# EAGLE design YOTSUBA_AP_EM_ver.1.1 (EAGLE 9.6.2)
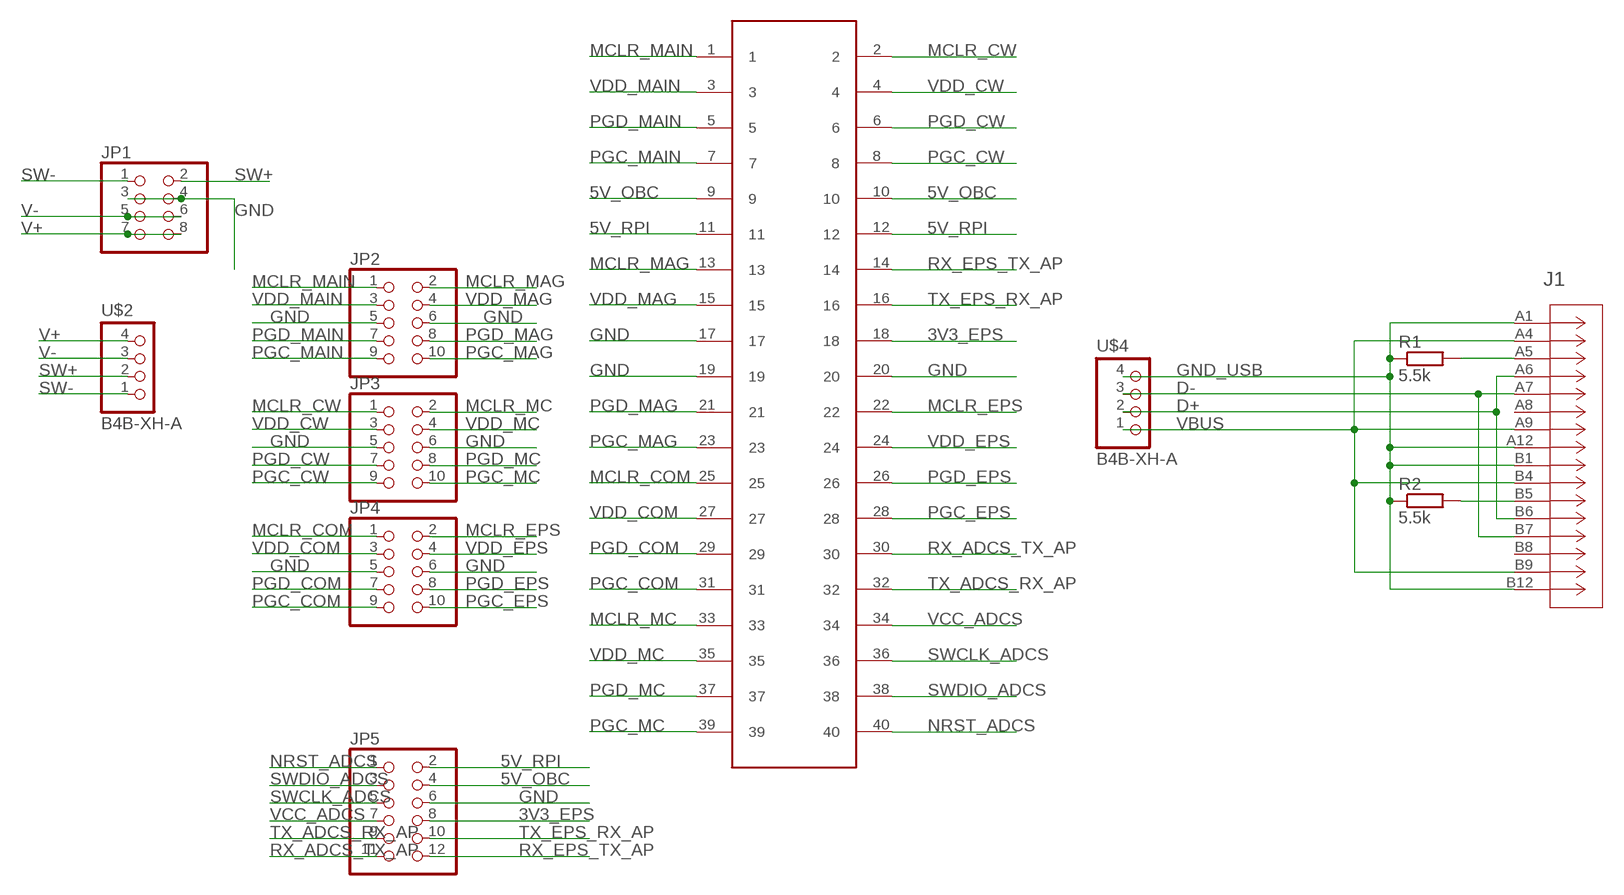
[diagram p0: schematic, sheet 1]

## Parts
J1  217182-0001  [CONN_217182-0001_MOL]
JP1  PINHD-2X4  [2X04]
JP2  PINHD-2X5  [2X05]
JP3  PINHD-2X5  [2X05]
JP4  PINHD-2X5  [2X05]
JP5  PINHD-2X6  [2X06]
R1  5.5k  R-EU_M2012  [M2012]
R2  5.5k  R-EU_M2012  [M2012]
U$1  M50-3902042  [M50-3902042]
U$2  B4B-XH-A  [B4B-XH-A]
U$4  B4B-XH-A  [B4B-XH-A]

## Nets
3V3_EPS: JP5.8 U$1.18
5V_OBC: JP5.4 U$1.9 U$1.10
5V_RPI: JP5.2 U$1.11 U$1.12
D+: J1.A6(DP1) J1.B6(DP2) U$4.2
D-: J1.A7(DN1) J1.B7(DN2) U$4.3
GND [gnd]: JP1.3 JP1.4 JP2.5 JP2.6 JP3.5 JP3.6 JP4.5 JP4.6 JP5.6 U$1.17 U$1.19 U$1.20
GND_USB [gnd_usb]: J1.A1(GND_2) J1.A12(GND_3) J1.B1(GND_4) J1.B12(GND) R1.1 R2.1 U$4.4
MCLR_COM: JP4.1 U$1.25
MCLR_CW: JP3.1 U$1.2
MCLR_EPS: JP4.2 U$1.22
MCLR_MAG: JP2.2 U$1.13
MCLR_MAIN: JP2.1 U$1.1
MCLR_MC: JP3.2 U$1.33
N$2: J1.A5(CC1) R1.2
N$3: J1.B5(CC2) R2.2
NRST_ADCS: JP5.1 U$1.40
PGC_COM: JP4.9 U$1.31
PGC_CW: JP3.9 U$1.8
PGC_EPS: JP4.10 U$1.28
PGC_MAG: JP2.10 U$1.23
PGC_MAIN: JP2.9 U$1.7
PGC_MC: JP3.10 U$1.39
PGD_COM: JP4.7 U$1.29
PGD_CW: JP3.7 U$1.6
PGD_EPS: JP4.8 U$1.26
PGD_MAG: JP2.8 U$1.21
PGD_MAIN: JP2.7 U$1.5
PGD_MC: JP3.8 U$1.37
RX_ADCS_TX_AP: JP5.11 U$1.30
RX_EPS_TX_AP: JP5.12 U$1.14
SW+ [pwr]: JP1.2 U$2.2
SW- [pwr]: JP1.1 U$2.1
SWCLK_ADCS: JP5.5 U$1.36
SWDIO_ADCS: JP5.3 U$1.38
TX_ADCS_RX_AP: JP5.9 U$1.32
TX_EPS_RX_AP: JP5.10 U$1.16
V+ [pwr]: JP1.7 JP1.8 U$2.4
V- [pwr]: JP1.5 JP1.6 U$2.3
VBUS: J1.A4(VBUS_2) J1.A9(VBUS_3) J1.B4(VBUS_4) J1.B9(VBUS) U$4.1
VCC_ADCS: JP5.7 U$1.34
VDD_COM: JP4.3 U$1.27
VDD_CW: JP3.3 U$1.4
VDD_EPS: JP4.4 U$1.24
VDD_MAG: JP2.4 U$1.15
VDD_MAIN: JP2.3 U$1.3
VDD_MC: JP3.4 U$1.35
Unconnected: J1.A8(SBU1) J1.B8(SBU2)

## Library data of the parts
J1 = 2171820001:217182-0001; COPYRIGHT: Copyright (C) 2022 Ultra Librarian. All rights reserved.; DIGI-KEY_PART_NUMBER_1: 900-2171820001TR-ND; DIGI-KEY_PART_NUMBER_2: 900-2171820001CT-ND; DIGI-KEY_PART_NUMBER_3: 900-2171820001DKR-ND; MANUFACTURER_PART_NUMBER: 217182-0001; MFR_NAME: Molex Connector Corporation
JP1 = pinhead:PINHD-2X4: PIN HEADER
JP2-JP4 = pinhead:PINHD-2X5: PIN HEADER
JP5 = pinhead:PINHD-2X6: PIN HEADER
R1 R2 = rcl:R-EU_: RESISTOR, European symbol; SPICEPREFIX: R
U$1 = MITSUBA_Connectors-v4.0:M50-3902042: 40pins 1.27mm pitch 2line pinheader
U$2 U$4 = MITSUBA_Connectors-v4.0:B4B-XH-A

## Net classes
0 default: clearance 0.254 mm
1 gnd: clearance 0.559 mm
2 pwr: clearance 0.229 mm
3 gnd_usb: clearance 0.025 mm

## Board
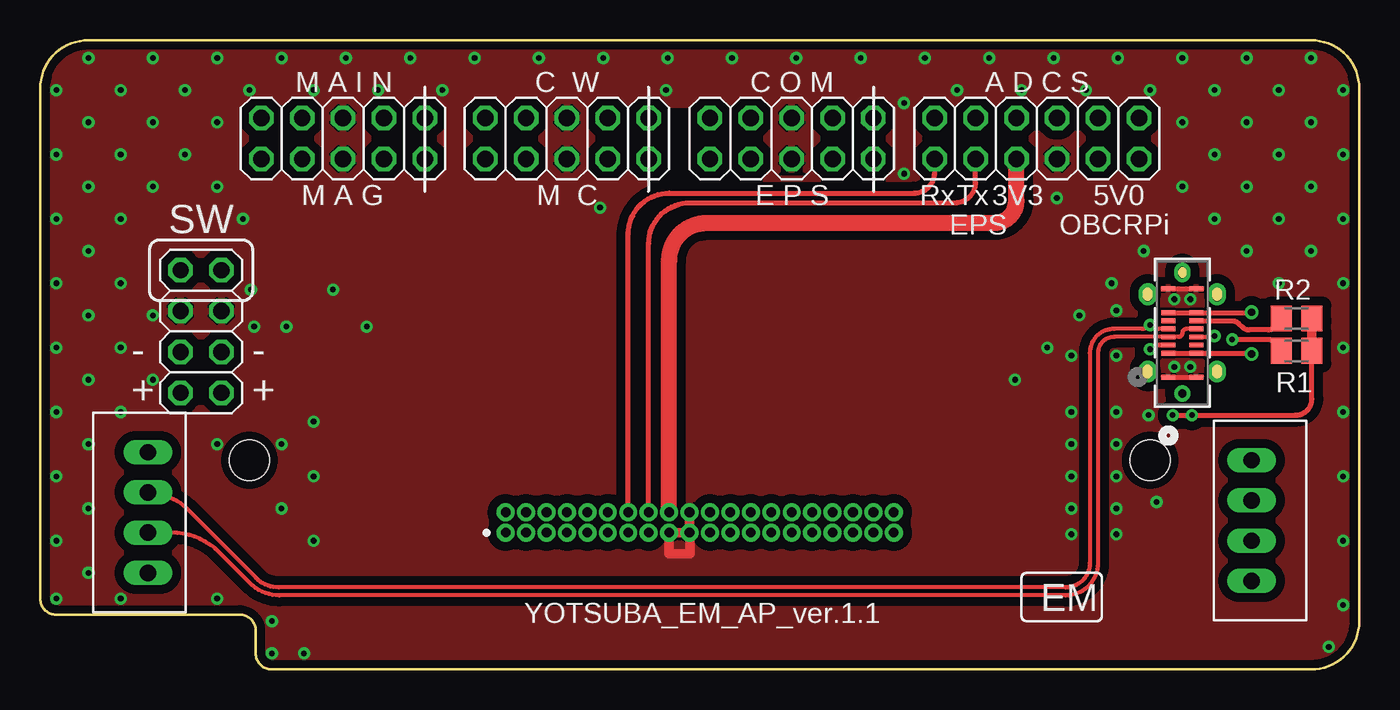
[diagram p1: board, top side]
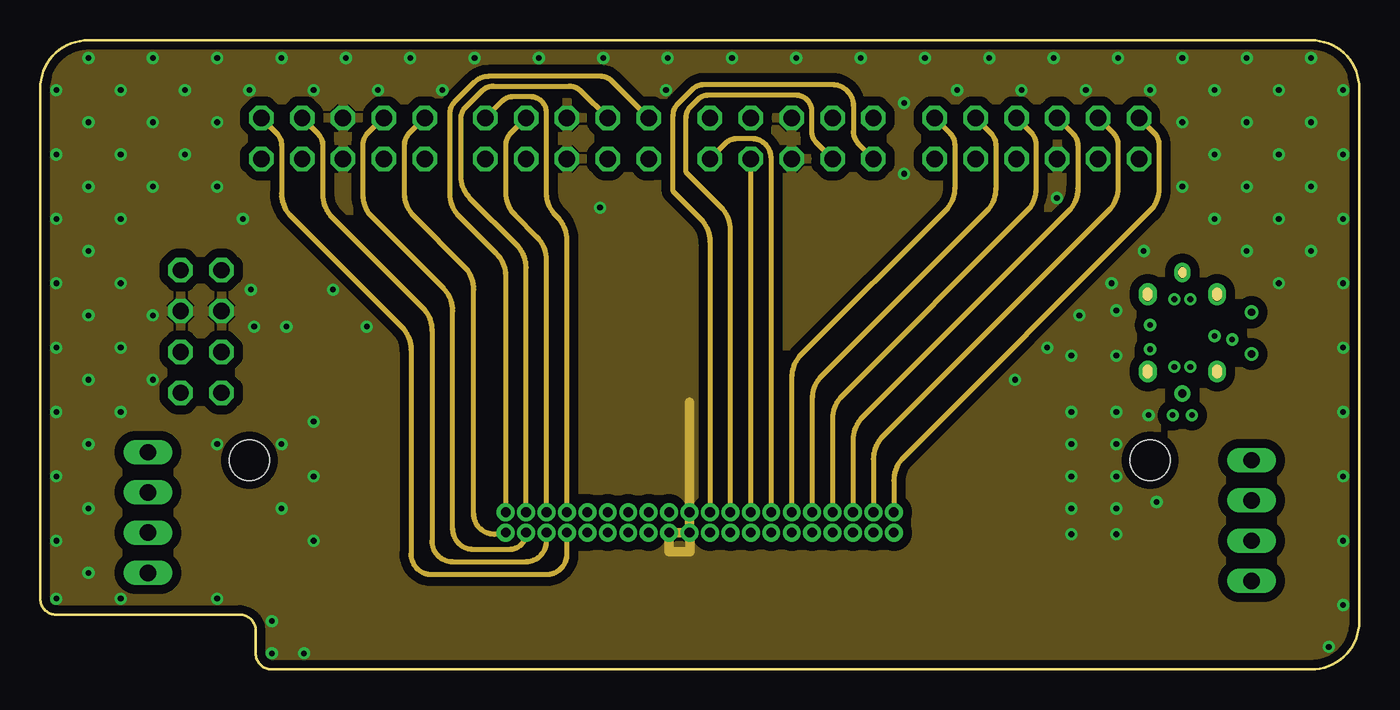
[diagram p2: board, inner layer Route2]
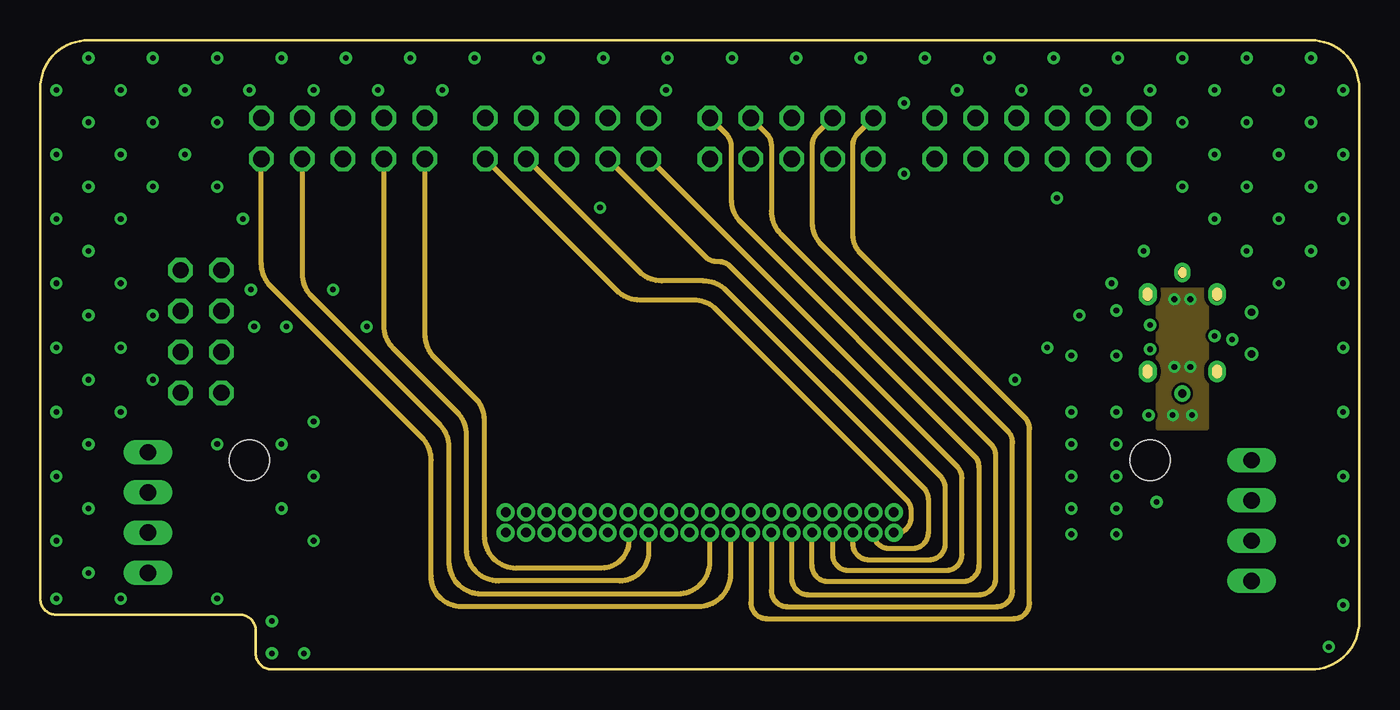
[diagram p3: board, inner layer Route15]
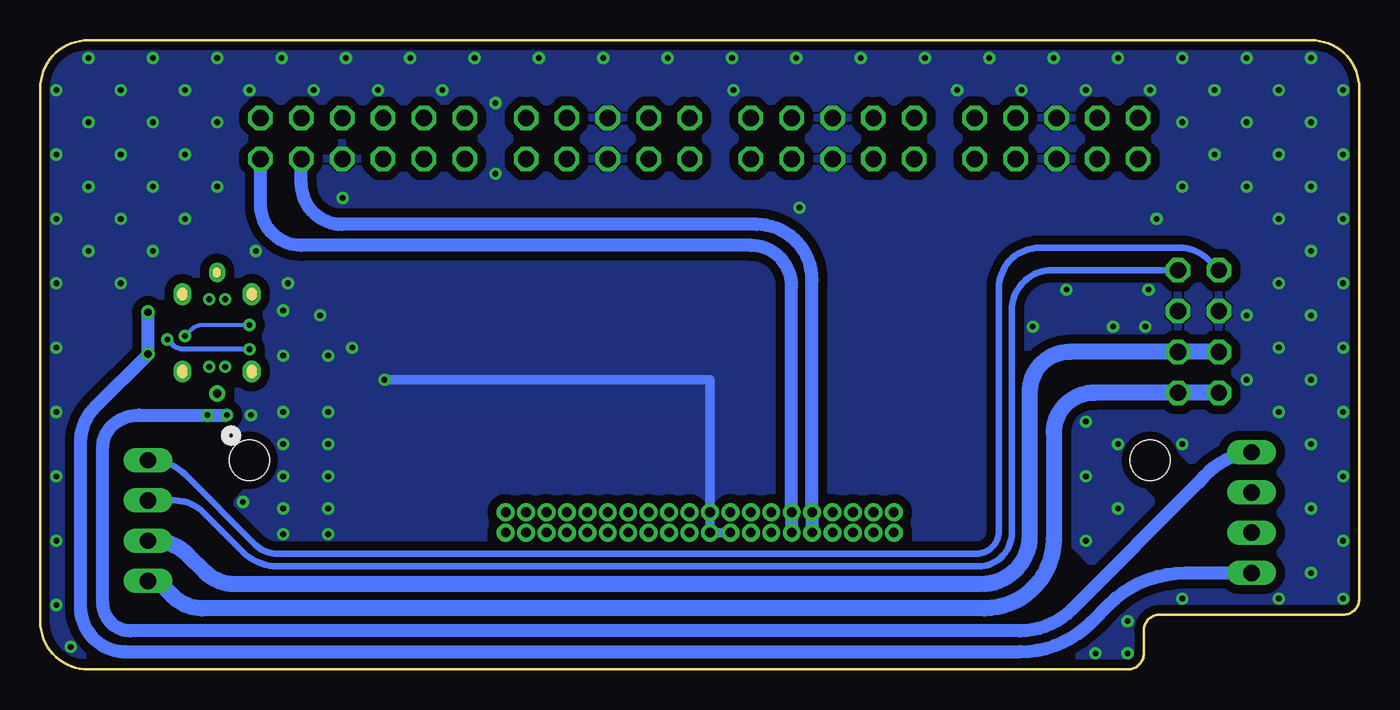
[diagram p4: board, bottom side, seen from below]

Size 82 x 39.1 mm. Coordinates in mm from the lower left corner, seen from the top.
Outline: 0,36.1 0,4.4 arc90 1,3.4 12.4,3.4 arc-90 13.4,2.4 13.4,1 arc90 14.4,0 79,0 arc90 82,3 82,36.1 arc90 79,39.1 3,39.1 arc90 0,36.1
Copper layers (1+2*15+16): Top 0.035mm / dielectric 1.5mm / Route2 0.035mm / dielectric 0.15mm / Route15 0.035mm / dielectric 0.2mm / Bottom 0.035mm
Design rules "default *": minimum track width 6mil, minimum drill 0.35mm, track to track 6mil, track to pad 6mil, pad to pad 6mil, via to via 6mil, smd to smd 6mil, copper to edge 20mil, drill to drill 6mil, minimum pad ring 10mil, minimum via ring 8mil, stop-mask expansion 4mil, vias tented up to drill 0mil, thermal gap 4mil
Holes 2.5 mm at 13,13 69,13
tRestrict: 2 lines
bRestrict: 4 lines

### Footprints (pad centres in the part's own frame; a part is rotated, then mirrored left to right if it is on the bottom)
CONN_217182-0001_MOL = smd 1.346 x 1.092: 17 -2.4,2.15; 18 2.4,2.15; 19 -2.4,-2.15; 20 2.4,-2.15 | drill 0.508 pad 0.508: 21 -3.759,0; S_1_H1 3.861,0; S_1_H2 3.658,0 | smd 0.305 x 0.864: A1 -2.75,0.865; A4 -1.25,0.865; A5 -0.75,0.865; A6 -0.25,0.865; A7 0.25,0.865; A8 0.75,0.865; A9 1.25,0.865; A12 2.75,0.865; B1 2.75,-0.865; B4 1.25,-0.865; B5 0.75,-0.865; B6 0.25,-0.865; B7 -0.25,-0.865; B8 -0.75,-0.865; B9 -1.25,-0.865; B12 -2.75,-0.865 | drill 0.61 pad 0.61: S_2_H1 -2.286,2.159; S_2_H2 -2.515,2.159; S_3_H1 2.515,2.159; S_3_H2 2.286,2.159; S_4_H1 -2.286,-2.159; S_4_H2 -2.515,-2.159; S_5_H1 2.515,-2.159; S_5_H2 2.286,-2.159
2X04 = drill 1.016 octagon: 1 -3.81,-1.27; 2 -3.81,1.27; 3 -1.27,-1.27; 4 -1.27,1.27; 5 1.27,-1.27; 6 1.27,1.27; 7 3.81,-1.27; 8 3.81,1.27
2X05 = drill 1.016 octagon: 1 -5.08,-1.27; 2 -5.08,1.27; 3 -2.54,-1.27; 4 -2.54,1.27; 5 0,-1.27; 6 0,1.27; 7 2.54,-1.27; 8 2.54,1.27; 9 5.08,-1.27; 10 5.08,1.27
2X06 = drill 1.016 octagon: 1 -6.35,-1.27; 2 -6.35,1.27; 3 -3.81,-1.27; 4 -3.81,1.27; 5 -1.27,-1.27; 6 -1.27,1.27; 7 1.27,-1.27; 8 1.27,1.27; 9 3.81,-1.27; 10 3.81,1.27; 11 6.35,-1.27; 12 6.35,1.27
M2012 = smd 1.3 x 1.6: 1 -0.95,0; 2 0.95,0
M50-3902042 = drill 0.6: 1 0,0; 2 0,1.27; 3 1.27,0; 4 1.27,1.27; 5 2.54,0; 6 2.54,1.27; 7 3.81,0; 8 3.81,1.27; 9 5.08,0; 10 5.08,1.27; 11 6.35,0; 12 6.35,1.27; 13 7.62,0; 14 7.62,1.27; 15 8.89,0; 16 8.89,1.27; 17 10.16,0; 18 10.16,1.27; 19 11.43,0; 20 11.43,1.27; 21 12.7,0; 22 12.7,1.27; 23 13.97,0; 24 13.97,1.27; 25 15.24,0; 26 15.24,1.27; 27 16.51,0; 28 16.51,1.27; 29 17.78,0; 30 17.78,1.27; 31 19.05,0; 32 19.05,1.27; 33 20.32,0; 34 20.32,1.27; 35 21.59,0; 36 21.59,1.27; 37 22.86,0; 38 22.86,1.27; 39 24.13,0; 40 24.13,1.27
B4B-XH-A = drill 1.016 long: 1 0,0; 2 2.5,0; 3 5,0; 4 7.5,0

### Placement (x,y rotation side)
J1  71,20.91 90 top
JP1  10,21 270 top
JP2  18.82,33 180 top
JP3  32.75,33 180 top
JP4  46.72,33 180 top
JP5  61.95,33 180 top
R1  78.1,19.8 180 top
R2  78.1,21.8 180 top
U$1  28.93,8.5 0 top
U$2  75.3,13 270 top
U$4  6.7,6 90 top

### Tracks (layer width: path | path; a pad name or v marks a point on that pad's centre or on a via)
3V3_EPS
  Top 1: U$1.18 39.09,25.41 arc-90 41.44,27.75 59.31,27.75 arc90 60.69,29.12 JP5.8
5V_OBC
  Bottom 0.8: U$1.9 U$1.10 34.02,24.21 arc-90 37.45,27.65 63.23,27.65 arc90 65.77,30.19 JP5.4
5V_RPI
  Bottom 0.8: U$1.11 U$1.12 35.28,23.81 arc-90 37.83,26.35 65.77,26.35 arc90 68.31,28.89 JP5.2
D+
  Top 0.261: J1.B6 71.25,21.16 arc90 71,20.91 arc-90 70.75,20.66 J1.A6 66.75,20.66 arc90 65.75,19.66 65.75,6.6 arc-90 63.75,4.6 14.87,4.6 arc-45 13.04,5.36 11.13,7.27 arc45 8.16,8.5 U$4.2
D-  (via drill 0.35)
  Top 0.261: J1.A7 69.5,21.16 arc-45 69.05,21.35 | J1.B7 72.94,20.66 | 68.95,21.35 arc-45 68.5,21.16 66.75,21.16 arc90 65.25,19.66 65.25,6.6 arc-90 63.75,5.1 14.83,5.1 arc-45 13.41,5.69 9.09,10.01 arc45 7.04,10.86
  Top 0.3: 69.05,21.35 v69,21.4 68.95,21.35 | 72.94,20.66 v73,20.72 | 7.04,10.86 6.9,11 U$4.3
  Bottom 0.261: v69,21.4 71.91,21.4 arc-45 72.62,21.11 v73,20.72
GND  (via drill 0.35)
  Top 0.6: U$1.19 U$1.17 39.09,7.2 40.4,7.2 40.4,8.5 U$1.19 | U$1.19 U$1.20
  Route2 0.6: U$1.19 U$1.17 39.09,7.3 40.4,7.3 40.4,8.5 U$1.19 | U$1.19 U$1.20 40.37,16.6
  Bottom 0.6: v60.6,18 40.37,18 U$1.20 U$1.19 U$1.17
  other vias: 39,38 35,38 31,38 27,38 23,38 19,38 15,38 11,38 7,38 3,38 1,36 1,32 1,28 1,24 1,20 1,16 1,12 1,8 1,4.4 14.4,1 43,38 47,38 51,38 55,38 59,38 63,38 67,38 71,38 75,38 79,38 81,36 81,32 81,28 81,24 81,20 81,16 81,12 81,8 81,4 80.1,1.4 5,4.4 11,4.4 14.4,3 16.4,1 5,36 9,36 7,34 3,34 3,30 5,32 5,28 3,26 5,24 3,22 5,20 3,18 5,16 3,14 3,10 9,32 7,30 11,34 13,36 11,30 12.6,28 13.1,23.6 15.3,21.3 20.3,21.3 18.2,23.6 11,14 15,14 15,10 17,12 17,15.4 17,8 7,22 7,18 13.3,21.3 77,36 79,34 77,32 75,34 73,36 71,34 73,32 71,30 73,28 75,30 77,28 79,30 79,26 75,26 68.6,26 77,24 66.6,24 64.6,22 62.6,20 66.9,19.5 66.9,22.3 64.1,19.5 64.1,16 66.9,16 64.1,14 66.9,14 66.9,12 64.1,12 64.1,10 66.9,10 66.9,8.4 64.1,8.4 63.2,29.3 53.7,30.8 53.7,35.2 69,36 65,36 61,36 57,36 38.9,36 17,36 21,36 25,36 34.8,28.7 69.4,10.4 68.9,15.8 3,6
  pour Bottom: -3.31,42.21 82.53,42.21 82.53,-4.02 -3.31,-4.02
  pour Route2: -2.14,43.48 84.85,43.48 84.85,-5.15 -2.14,-5.15
  pour Top: -1.9,43.2 -1.9,-3.5 84,-3.5 84,43.2
GND_USB  (via drill 0.35)
  Top 0.3: J1.A12 J1.B1 72.06,23.66 | J1.A1 J1.B12 | v70.4,15.8 v71.6,15.8 78.05,15.8 arc90 79.05,16.8 R1.1 | 79.05,21.65 79.22,21.65
  Top 0.6: R1.1 79.05,21.65
  Top 1: 79.22,21.65 R2.1
  Bottom 0.8: U$4.4 arc-45 9.94,11.66 17.88,3.72 arc45 21.07,2.4 76.4,2.4 arc90 78.1,4.1 78.1,13.85 arc45 77.59,15.09 arc45 75.87,15.8 v70.4,15.8
  other vias: 70.5,18.8 71.5,18.8 70.5,23 71.5,23
  pour Route15: 69.5,23.6 72.5,23.6 72.5,15 69.5,15
  pour Top: 69.8,23.8 72.2,23.8 72.2,22.5 69.8,22.5
  pour Top: 69.8,19.2 72.2,19.2 72.2,18.2 69.8,18.2
MCLR_COM
  Route15 0.3: U$1.25 44.17,4.15 arc90 45.17,3.15 60.5,3.15 arc90 61.5,4.15 61.5,14.93 arc45 61.21,15.64 51.01,25.84 arc-45 50.52,27.02 50.52,32.58 arc-45 50.81,33.29 JP4.1
MCLR_CW
  Route2 0.3: JP3.1 35.51,36.59 arc45 34.87,36.85 27.86,36.85 arc45 26.99,36.49 25.74,35.24 arc45 25.45,34.54 25.45,29.58 arc45 26.04,28.16 28.35,25.85 arc-45 28.93,24.44 U$1.2
MCLR_EPS
  Route2 0.3: U$1.22 41.63,26.59 arc45 41.05,28 39.35,29.7 39.35,34.44 arc-45 39.64,35.14 40.56,36.06 arc-45 41.26,36.35 49.24,36.35 arc-45 50.16,35.97 arc-45 50.55,35.04 50.55,33.41 arc45 50.84,32.71 51.8,31.75 JP4.2
MCLR_MAG
  Route15 0.3: JP2.2 23.91,20.82 arc45 24.49,19.41 27.01,16.89 arc-45 27.6,15.47 27.6,8.3 arc90 29.6,6.3 34.89,6.3 arc90 36.59,8 36.59,8.46 U$1.13
MCLR_MAIN
  Route2 0.3: U$1.1 28.84,8.4 28.22,8.4 arc-90 26.95,9.67 26.95,23.62 arc45 26.36,25.04 23.24,28.16 arc-45 22.65,29.58 22.65,32.6 arc-45 22.94,33.31 JP2.1
MCLR_MC
  Route15 0.3: U$1.33 49.26,7.15 arc90 50.26,6.15 56.3,6.15 arc90 57.3,7.15 57.3,11.89 arc45 57.01,12.59 37.87,31.73 JP3.2
N$2  (via drill 0.35)
  Top 0.3: J1.A5 69.5,20.16 arc45 69.05,19.97 69,19.93 v69,19.9 | v74.1,20.5 76.34,20.5 arc-45 76.79,20.31 77.15,19.95 R1.2
  Bottom 0.3: v69,19.9 73.09,19.9 arc45 73.79,20.19 v74.1,20.5
N$3
  Top 0.3: 77.28,21.66 R2.2 77.15,21.65 76.79,21.29 arc-45 76.34,21.1 75.16,21.1 arc-45 74.71,21.29 74.53,21.47 arc45 74.08,21.66 J1.B5
NRST_ADCS
  Route2 0.3: U$1.40 53.06,11.74 arc-45 53.65,13.15 68.96,28.46 arc45 69.55,29.88 69.55,32.61 arc45 69.26,33.32 JP5.1
PGC_COM
  Route15 0.3: JP4.9 42.66,33.25 arc-45 42.95,32.54 42.95,29.23 arc45 43.54,27.81 58.06,13.29 arc-45 58.35,12.59 58.35,6.45 arc-90 57.35,5.45 48.98,5.45 arc-90 47.98,6.45 U$1.31
PGC_CW
  Route2 0.3: U$1.8 32.75,26.68 arc45 32.16,28.09 32.06,28.19 arc-45 31.47,29.6 31.47,34.59 arc90 30.47,35.59 29.41,35.59 arc45 28.7,35.3 JP3.9
PGC_EPS
  Route2 0.3: U$1.28 45.45,31.74 arc45 45.07,32.64 arc45 44.26,32.98 43.3,32.98 arc45 42.59,32.69 JP4.10
PGC_MAG
  Route15 0.3: U$1.23 42.91,5.9 arc-90 40.91,3.9 26.2,3.9 arc-90 24.3,5.8 24.3,13.02 arc45 23.71,14.44 14.33,23.82 arc-45 13.75,25.23 JP2.10
PGC_MAIN
  Route2 0.3: JP2.9 14.71,33.31 arc-45 15,32.6 15,29.58 arc45 15.59,28.16 22.46,21.29 arc-45 23.05,19.87 23.05,7.17 arc90 24.32,5.9 31.48,5.9 arc90 32.75,7.17 U$1.7
PGC_MC
  Route15 0.3: U$1.39 53.1,8.46 53.15,8.46 arc90 54.15,9.46 54.15,9.84 arc45 53.86,10.54 42.04,22.36 arc45 40.62,22.95 37.28,22.95 arc-45 35.86,23.54 JP3.10
PGD_COM
  Route15 0.3: U$1.29 46.72,5.65 arc90 47.72,4.65 58.4,4.65 arc90 59.4,5.65 59.4,13.29 arc45 59.11,13.99 46.03,27.07 arc-45 45.44,28.48 45.44,32.59 arc45 45.15,33.29 JP4.7
PGD_CW
  Route2 0.3: U$1.6 31.48,25.45 arc45 30.89,26.86 29.54,28.21 arc-45 28.95,29.63 28.95,32.6 arc-45 29.24,33.31 JP3.7
PGD_EPS
  Route2 0.3: U$1.26 JP4.8
PGD_MAG
  Route15 0.3: JP2.8 16.29,24.59 arc45 16.87,23.18 24.81,15.24 arc-45 25.4,13.82 25.4,6.7 arc90 27.4,4.7 39.63,4.7 arc90 41.63,6.7 U$1.21
PGD_MAIN
  Route2 0.3: JP2.7 17.27,33.29 arc-45 17.56,32.58 17.56,29.52 arc45 18.14,28.11 23.76,22.49 arc-45 24.35,21.07 24.35,7.97 arc90 25.62,6.7 30.2,6.7 arc90 31.48,7.97 U$1.5
PGD_MC
  Route15 0.3: U$1.37 arc90 52.8,7.5 54.2,7.5 arc90 55.2,8.5 55.2,10.59 arc45 54.91,11.29 42.64,23.56 arc45 41.22,24.15 38.63,24.15 arc-45 37.21,24.74 JP3.8
RX_ADCS_TX_AP
  Route2 0.3: U$1.30 46.72,18.14 arc-45 47.3,19.55 56.26,28.51 arc45 56.85,29.93 56.85,32.61 arc45 56.56,33.32 JP5.11
RX_EPS_TX_AP
  Top 0.3: JP5.12 55.6,30.87 arc-90 54.34,29.6 39.09,29.6 arc90 36.55,27.06 U$1.14
SW+
  Bottom 0.4: JP1.2 19.1,24.81 arc-90 21.6,22.31 21.6,8.5 arc90 23.7,6.4 67.21,6.4 arc45 69.41,7.32 71.87,9.77 arc-45 73.64,10.5 U$2.2
SW-
  Bottom 0.4: JP1.1 9.39,25.47 arc-45 11.16,26.2 19.9,26.2 arc-90 22.4,23.7 22.4,8.59 arc90 23.8,7.19 67.25,7.19 arc45 68.63,7.76 72.97,12.1 arc-45 75.15,13 U$2.1
SWCLK_ADCS
  Route2 0.3: U$1.36 50.52,14.25 arc-45 51.11,15.66 63.91,28.46 arc45 64.5,29.88 64.5,32.58 arc45 64.21,33.29 JP5.5
SWDIO_ADCS
  Route2 0.3: JP5.3 66.71,33.33 arc-45 67,32.62 67,29.93 arc-45 66.41,28.51 52.38,14.48 arc45 51.8,13.07 U$1.38
TX_ADCS_RX_AP
  Route2 0.3: U$1.32 47.98,16.81 arc-45 48.57,18.22 58.81,28.46 arc45 59.4,29.88 59.4,32.6 arc45 59.11,33.31 JP5.9
TX_EPS_RX_AP
  Top 0.3: JP5.10 58.15,30.27 arc-90 56.88,29 40.37,29 arc90 37.83,26.46 U$1.16
V+
  Bottom 1: JP1.7 JP1.8 16.5,17.19 arc-90 19,14.69 19,8.1 arc90 23.3,3.8 71.91,3.8 arc45 73.77,4.57 74.7,5.5 U$2.4
V-
  Bottom 1: JP1.5 JP1.6 18,19.73 arc-90 20.5,17.23 20.5,8.3 arc90 23.5,5.3 69.93,5.3 arc45 71.76,6.06 72.81,7.11 arc-45 74.96,8 U$2.3
VBUS  (via drill 0.45)
  Top 0.3: J1.A9 J1.B4 75.3,22.16 v75.3,22.2 | J1.A4 J1.B9 75.3,19.66 v75.3,19.6
  Bottom 0.8: v75.3,22.2 v75.3,19.6 78.6,16.3 arc-45 79.5,14.13 79.5,3.9 arc-90 76.7,1.1 21.05,1.1 arc-45 16.69,2.91 15.56,4.04 arc45 10.82,6 U$4.1
VCC_ADCS
  Route2 0.3: U$1.34 49.26,15.58 arc-45 49.84,16.99 61.31,28.46 arc45 61.9,29.88 61.9,32.64 arc45 61.61,33.35 JP5.7
VDD_COM
  Route15 0.3: U$1.27 45.45,4.9 arc90 46.45,3.9 59.45,3.9 arc90 60.45,4.9 60.45,14.09 arc45 60.16,14.79 48.59,26.36 arc-45 48.01,27.77 48.01,32.61 arc-45 48.3,33.31 JP4.3
VDD_CW
  Route2 0.3: U$1.4 30.2,24.97 arc45 29.62,26.38 26.74,29.26 arc-45 26.15,30.68 26.15,34.24 arc-45 26.44,34.94 27.46,35.96 arc-45 28.16,36.25 32.89,36.25 arc-45 33.6,35.96 JP3.3
VDD_EPS
  Route2 0.3: U$1.24 42.91,27.32 arc45 42.32,28.73 40.15,30.9 40.15,34.29 arc-45 40.44,34.99 40.86,35.41 arc-45 41.56,35.7 46.95,35.7 arc-90 47.95,34.7 47.95,33.44 arc45 48.25,32.74 JP4.4
VDD_MAG
  Route15 0.3: U$1.15 37.83,7.3 arc-90 36.02,5.5 28.5,5.5 arc-90 26.5,7.5 26.5,14.57 arc45 25.91,15.99 21.95,19.95 arc-45 21.37,21.36 JP2.4
VDD_MAIN
  Route2 0.3: U$1.3 arc-90 29.16,7.45 26.92,7.45 arc-90 25.65,8.72 25.65,22.27 arc45 25.06,23.69 20.66,28.09 arc-45 20.07,29.51 20.07,32.61 arc-45 20.36,33.32 21.31,34.27 JP2.3
VDD_MC
  Route15 0.3: JP3.4 35.28,31.71 41.36,25.64 arc45 42.06,25.35 42.19,25.35 arc-45 42.89,25.06 55.96,11.99 arc-45 56.25,11.29 56.25,7.8 arc-90 55.25,6.8 51.52,6.8 arc-90 50.52,7.8 U$1.35

### Text on the board
tNames: M A I N | C W | C O M | A D C S | M A G | M C | E P S | Rx | Tx | 3V3 | 5V0 | SW | EPS | OBC | RPi | - | - | + | + | YOTSUBA_EM_AP_ver.1.1 | EM